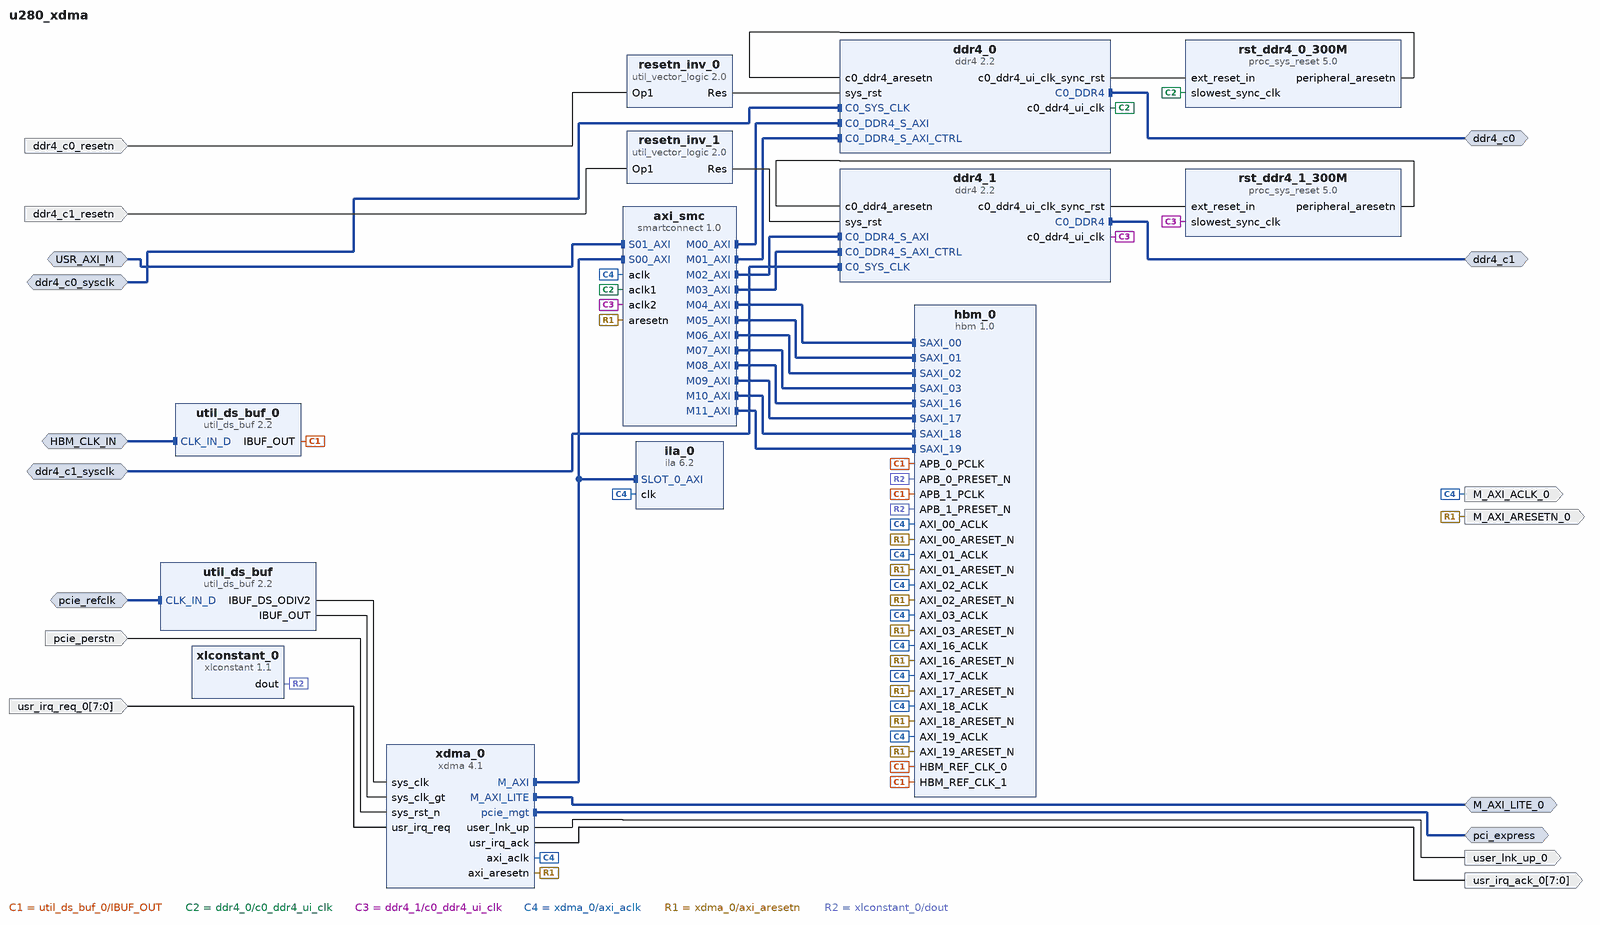
[diagram p0: block diagram of the top level]
# Vivado block design u280_xdma, xcu280-fsvh2892-2L-e, Vivado 2022.2
create_bd_design u280_xdma

create_bd_intf_port -mode Master -vlnv xilinx.com:interface:ddr4_rtl:1.0 ddr4_c0
create_bd_intf_port -mode Slave -vlnv xilinx.com:interface:diff_clock_rtl:1.0 ddr4_c0_sysclk
set_property -dict {CONFIG.FREQ_HZ 100000000} [get_bd_intf_ports ddr4_c0_sysclk]
create_bd_intf_port -mode Master -vlnv xilinx.com:interface:pcie_7x_mgt_rtl:1.0 pci_express
create_bd_intf_port -mode Slave -vlnv xilinx.com:interface:diff_clock_rtl:1.0 pcie_refclk
set_property -dict {CONFIG.FREQ_HZ 100000000} [get_bd_intf_ports pcie_refclk]
create_bd_intf_port -mode Master -vlnv xilinx.com:interface:aximm_rtl:1.0 M_AXI_LITE_0
set_property -dict [list \
  CONFIG.ADDR_WIDTH 32 \
  CONFIG.DATA_WIDTH 32 \
  CONFIG.HAS_BURST 0 \
  CONFIG.HAS_CACHE 0 \
  CONFIG.HAS_LOCK 0 \
  CONFIG.HAS_QOS 0 \
  CONFIG.HAS_REGION 0 \
  CONFIG.PROTOCOL AXI4LITE \
] [get_bd_intf_ports M_AXI_LITE_0]
create_bd_intf_port -mode Master -vlnv xilinx.com:interface:ddr4_rtl:1.0 ddr4_c1
create_bd_intf_port -mode Slave -vlnv xilinx.com:interface:diff_clock_rtl:1.0 ddr4_c1_sysclk
set_property -dict {CONFIG.FREQ_HZ 100000000} [get_bd_intf_ports ddr4_c1_sysclk]
create_bd_intf_port -mode Slave -vlnv xilinx.com:interface:diff_clock_rtl:1.0 HBM_CLK_IN
create_bd_intf_port -mode Slave -vlnv xilinx.com:interface:aximm_rtl:1.0 USR_AXI_M
set_property -dict [list \
  CONFIG.ADDR_WIDTH 64 \
  CONFIG.ARUSER_WIDTH 0 \
  CONFIG.AWUSER_WIDTH 0 \
  CONFIG.BUSER_WIDTH 0 \
  CONFIG.CLK_DOMAIN u280_xdma_xdma_0_1_axi_aclk \
  CONFIG.DATA_WIDTH 512 \
  CONFIG.FREQ_HZ 250000000 \
  CONFIG.HAS_BRESP 1 \
  CONFIG.HAS_BURST 1 \
  CONFIG.HAS_CACHE 1 \
  CONFIG.HAS_LOCK 1 \
  CONFIG.HAS_PROT 1 \
  CONFIG.HAS_QOS 1 \
  CONFIG.HAS_REGION 1 \
  CONFIG.HAS_RRESP 1 \
  CONFIG.HAS_WSTRB 1 \
  CONFIG.ID_WIDTH 4 \
  CONFIG.MAX_BURST_LENGTH 256 \
  CONFIG.NUM_READ_OUTSTANDING 32 \
  CONFIG.NUM_READ_THREADS 1 \
  CONFIG.NUM_WRITE_OUTSTANDING 16 \
  CONFIG.NUM_WRITE_THREADS 1 \
  CONFIG.PROTOCOL AXI4 \
  CONFIG.READ_WRITE_MODE READ_WRITE \
  CONFIG.RUSER_BITS_PER_BYTE 0 \
  CONFIG.RUSER_WIDTH 0 \
  CONFIG.SUPPORTS_NARROW_BURST 0 \
  CONFIG.WUSER_BITS_PER_BYTE 0 \
  CONFIG.WUSER_WIDTH 0 \
  CONFIG.master_id 2 \
] [get_bd_intf_ports USR_AXI_M]
create_bd_port -dir I -type rst pcie_perstn
set_property -dict {CONFIG.POLARITY ACTIVE_LOW} [get_bd_ports pcie_perstn]
create_bd_port -dir O -type clk M_AXI_ACLK_0
create_bd_port -dir O -type rst M_AXI_ARESETN_0
create_bd_port -dir O user_lnk_up_0
create_bd_port -dir O -from 7 -to 0 usr_irq_ack_0
create_bd_port -dir I -type rst ddr4_c0_resetn
set_property -dict {CONFIG.POLARITY ACTIVE_LOW} [get_bd_ports ddr4_c0_resetn]
create_bd_port -dir I -from 7 -to 0 usr_irq_req_0
create_bd_port -dir I -type rst ddr4_c1_resetn
set_property -dict {CONFIG.POLARITY ACTIVE_LOW} [get_bd_ports ddr4_c1_resetn]

create_bd_cell -type ip -vlnv xilinx.com:ip:ddr4:2.2 ddr4_0
set_property -dict [list \
  CONFIG.C0_CLOCK_BOARD_INTERFACE sysclk0 \
  CONFIG.C0_DDR4_BOARD_INTERFACE ddr4_sdram_c0 \
  CONFIG.RESET_BOARD_INTERFACE resetn \
] [get_bd_cells ddr4_0]
create_bd_cell -type ip -vlnv xilinx.com:ip:xdma:4.1 xdma_0
set_property -dict [list \
  CONFIG.PCIE_BOARD_INTERFACE pci_express_x16 \
  CONFIG.SYS_RST_N_BOARD_INTERFACE pcie_perstn \
  CONFIG.axilite_master_en true \
  CONFIG.cfg_mgmt_if false \
  CONFIG.pf0_msi_enabled false \
  CONFIG.xdma_axi_intf_mm AXI_Memory_Mapped \
  CONFIG.xdma_num_usr_irq 8 \
] [get_bd_cells xdma_0]
create_bd_cell -type ip -vlnv xilinx.com:ip:util_ds_buf:2.2 util_ds_buf
set_property -dict {CONFIG.DIFF_CLK_IN_BOARD_INTERFACE pcie_refclk CONFIG.USE_BOARD_FLOW true} [get_bd_cells util_ds_buf]
create_bd_cell -type ip -vlnv xilinx.com:ip:smartconnect:1.0 axi_smc
set_property -dict [list \
  CONFIG.ADVANCED_PROPERTIES { __view__ { }} \
  CONFIG.NUM_CLKS 3 \
  CONFIG.NUM_MI 12 \
  CONFIG.NUM_SI 2 \
] [get_bd_cells axi_smc]
create_bd_cell -type ip -vlnv xilinx.com:ip:proc_sys_reset:5.0 rst_ddr4_0_300M
create_bd_cell -type ip -vlnv xilinx.com:ip:util_vector_logic:2.0 resetn_inv_0
set_property -dict {CONFIG.C_OPERATION not CONFIG.C_SIZE 1} [get_bd_cells resetn_inv_0]
create_bd_cell -type ip -vlnv xilinx.com:ip:ddr4:2.2 ddr4_1
set_property -dict [list \
  CONFIG.C0_CLOCK_BOARD_INTERFACE sysclk1 \
  CONFIG.C0_DDR4_BOARD_INTERFACE ddr4_sdram_c1 \
  CONFIG.RESET_BOARD_INTERFACE resetn \
] [get_bd_cells ddr4_1]
create_bd_cell -type ip -vlnv xilinx.com:ip:util_vector_logic:2.0 resetn_inv_1
set_property -dict {CONFIG.C_OPERATION not CONFIG.C_SIZE 1} [get_bd_cells resetn_inv_1]
create_bd_cell -type ip -vlnv xilinx.com:ip:proc_sys_reset:5.0 rst_ddr4_1_300M
create_bd_cell -type ip -vlnv xilinx.com:ip:ila:6.2 ila_0
set_property -dict {CONFIG.C_DATA_DEPTH 4096} [get_bd_cells ila_0]
create_bd_cell -type ip -vlnv xilinx.com:ip:hbm:1.0 hbm_0
set_property -dict [list \
  CONFIG.USER_APB_EN false \
  CONFIG.USER_AUTO_POPULATE yes \
  CONFIG.USER_HBM_DENSITY 8GB \
  CONFIG.USER_MC0_TEMP_CTRL_SELF_REF_INTVL false \
  CONFIG.USER_MC_ENABLE_00 TRUE \
  CONFIG.USER_MC_ENABLE_02 FALSE \
  CONFIG.USER_MC_ENABLE_03 FALSE \
  CONFIG.USER_MC_ENABLE_04 FALSE \
  CONFIG.USER_MC_ENABLE_05 FALSE \
  CONFIG.USER_MC_ENABLE_06 FALSE \
  CONFIG.USER_MC_ENABLE_07 FALSE \
  CONFIG.USER_MC_ENABLE_10 FALSE \
  CONFIG.USER_MC_ENABLE_11 FALSE \
  CONFIG.USER_MC_ENABLE_12 FALSE \
  CONFIG.USER_MC_ENABLE_13 FALSE \
  CONFIG.USER_MC_ENABLE_14 FALSE \
  CONFIG.USER_MC_ENABLE_15 FALSE \
  CONFIG.USER_SAXI_19 true \
  CONFIG.USER_SWITCH_ENABLE_00 FALSE \
  CONFIG.USER_SWITCH_ENABLE_01 FALSE \
] [get_bd_cells hbm_0]
create_bd_cell -type ip -vlnv xilinx.com:ip:xlconstant:1.1 xlconstant_0
create_bd_cell -type ip -vlnv xilinx.com:ip:util_ds_buf:2.2 util_ds_buf_0

# ---- connections ----

connect_bd_intf_net -intf_net CLK_IN_D_0_1 [get_bd_intf_ports HBM_CLK_IN] [get_bd_intf_pins util_ds_buf_0/CLK_IN_D]
connect_bd_intf_net [get_bd_intf_ports USR_AXI_M] [get_bd_intf_pins axi_smc/S01_AXI]
connect_bd_intf_net [get_bd_intf_pins axi_smc/M00_AXI] [get_bd_intf_pins ddr4_0/C0_DDR4_S_AXI]
connect_bd_intf_net [get_bd_intf_pins axi_smc/M01_AXI] [get_bd_intf_pins ddr4_0/C0_DDR4_S_AXI_CTRL]
connect_bd_intf_net [get_bd_intf_pins ddr4_1/C0_DDR4_S_AXI] [get_bd_intf_pins axi_smc/M02_AXI]
connect_bd_intf_net [get_bd_intf_pins axi_smc/M03_AXI] [get_bd_intf_pins ddr4_1/C0_DDR4_S_AXI_CTRL]
connect_bd_intf_net [get_bd_intf_pins axi_smc/M04_AXI] [get_bd_intf_pins hbm_0/SAXI_00]
connect_bd_intf_net [get_bd_intf_pins axi_smc/M05_AXI] [get_bd_intf_pins hbm_0/SAXI_01]
connect_bd_intf_net [get_bd_intf_pins axi_smc/M06_AXI] [get_bd_intf_pins hbm_0/SAXI_02]
connect_bd_intf_net [get_bd_intf_pins axi_smc/M07_AXI] [get_bd_intf_pins hbm_0/SAXI_03]
connect_bd_intf_net [get_bd_intf_pins hbm_0/SAXI_16] [get_bd_intf_pins axi_smc/M08_AXI]
connect_bd_intf_net [get_bd_intf_pins hbm_0/SAXI_17] [get_bd_intf_pins axi_smc/M09_AXI]
connect_bd_intf_net [get_bd_intf_pins hbm_0/SAXI_18] [get_bd_intf_pins axi_smc/M10_AXI]
connect_bd_intf_net [get_bd_intf_pins hbm_0/SAXI_19] [get_bd_intf_pins axi_smc/M11_AXI]
connect_bd_intf_net [get_bd_intf_ports ddr4_c0] [get_bd_intf_pins ddr4_0/C0_DDR4]
connect_bd_intf_net [get_bd_intf_ports ddr4_c1] [get_bd_intf_pins ddr4_1/C0_DDR4]
connect_bd_intf_net [get_bd_intf_ports pcie_refclk] [get_bd_intf_pins util_ds_buf/CLK_IN_D]
connect_bd_intf_net -intf_net sysclk0_1 [get_bd_intf_ports ddr4_c0_sysclk] [get_bd_intf_pins ddr4_0/C0_SYS_CLK]
connect_bd_intf_net -intf_net sysclk1_1 [get_bd_intf_ports ddr4_c1_sysclk] [get_bd_intf_pins ddr4_1/C0_SYS_CLK]
connect_bd_intf_net [get_bd_intf_pins xdma_0/M_AXI] [get_bd_intf_pins axi_smc/S00_AXI]
connect_bd_intf_net [get_bd_intf_pins xdma_0/M_AXI] [get_bd_intf_pins ila_0/SLOT_0_AXI]
connect_bd_intf_net [get_bd_intf_ports M_AXI_LITE_0] [get_bd_intf_pins xdma_0/M_AXI_LITE]
connect_bd_intf_net [get_bd_intf_ports pci_express] [get_bd_intf_pins xdma_0/pcie_mgt]
connect_bd_net -net clk_100MHz_1 [get_bd_pins util_ds_buf_0/IBUF_OUT] \
  [get_bd_pins hbm_0/HBM_REF_CLK_0] [get_bd_pins hbm_0/APB_0_PCLK] [get_bd_pins hbm_0/APB_1_PCLK] \
  [get_bd_pins hbm_0/HBM_REF_CLK_1]
connect_bd_net [get_bd_pins ddr4_0/c0_ddr4_ui_clk] [get_bd_pins rst_ddr4_0_300M/slowest_sync_clk] [get_bd_pins axi_smc/aclk1]
connect_bd_net [get_bd_pins ddr4_0/c0_ddr4_ui_clk_sync_rst] [get_bd_pins rst_ddr4_0_300M/ext_reset_in]
connect_bd_net [get_bd_pins ddr4_1/c0_ddr4_ui_clk] [get_bd_pins rst_ddr4_1_300M/slowest_sync_clk] [get_bd_pins axi_smc/aclk2]
connect_bd_net [get_bd_pins ddr4_1/c0_ddr4_ui_clk_sync_rst] [get_bd_pins rst_ddr4_1_300M/ext_reset_in]
connect_bd_net [get_bd_ports pcie_perstn] [get_bd_pins xdma_0/sys_rst_n]
connect_bd_net -net resetn_1 [get_bd_ports ddr4_c0_resetn] [get_bd_pins resetn_inv_0/Op1]
connect_bd_net -net resetn_2 [get_bd_ports ddr4_c1_resetn] [get_bd_pins resetn_inv_1/Op1]
connect_bd_net [get_bd_pins resetn_inv_0/Res] [get_bd_pins ddr4_0/sys_rst]
connect_bd_net [get_bd_pins resetn_inv_1/Res] [get_bd_pins ddr4_1/sys_rst]
connect_bd_net [get_bd_pins rst_ddr4_0_300M/peripheral_aresetn] [get_bd_pins ddr4_0/c0_ddr4_aresetn]
connect_bd_net [get_bd_pins rst_ddr4_1_300M/peripheral_aresetn] [get_bd_pins ddr4_1/c0_ddr4_aresetn]
connect_bd_net -net usr_irq_req_0_1 [get_bd_ports usr_irq_req_0] [get_bd_pins xdma_0/usr_irq_req]
connect_bd_net [get_bd_pins util_ds_buf/IBUF_DS_ODIV2] [get_bd_pins xdma_0/sys_clk]
connect_bd_net [get_bd_pins util_ds_buf/IBUF_OUT] [get_bd_pins xdma_0/sys_clk_gt]
connect_bd_net [get_bd_pins xdma_0/axi_aclk] \
  [get_bd_ports M_AXI_ACLK_0] [get_bd_pins axi_smc/aclk] [get_bd_pins ila_0/clk] [get_bd_pins hbm_0/AXI_00_ACLK] \
  [get_bd_pins hbm_0/AXI_01_ACLK] [get_bd_pins hbm_0/AXI_02_ACLK] [get_bd_pins hbm_0/AXI_03_ACLK] \
  [get_bd_pins hbm_0/AXI_16_ACLK] [get_bd_pins hbm_0/AXI_17_ACLK] [get_bd_pins hbm_0/AXI_18_ACLK] \
  [get_bd_pins hbm_0/AXI_19_ACLK]
connect_bd_net [get_bd_pins xdma_0/axi_aresetn] \
  [get_bd_ports M_AXI_ARESETN_0] [get_bd_pins axi_smc/aresetn] [get_bd_pins hbm_0/AXI_00_ARESET_N] \
  [get_bd_pins hbm_0/AXI_01_ARESET_N] [get_bd_pins hbm_0/AXI_02_ARESET_N] [get_bd_pins hbm_0/AXI_03_ARESET_N] \
  [get_bd_pins hbm_0/AXI_19_ARESET_N] [get_bd_pins hbm_0/AXI_18_ARESET_N] [get_bd_pins hbm_0/AXI_17_ARESET_N] \
  [get_bd_pins hbm_0/AXI_16_ARESET_N]
connect_bd_net [get_bd_pins xdma_0/user_lnk_up] [get_bd_ports user_lnk_up_0]
connect_bd_net [get_bd_pins xdma_0/usr_irq_ack] [get_bd_ports usr_irq_ack_0]
connect_bd_net [get_bd_pins xlconstant_0/dout] [get_bd_pins hbm_0/APB_0_PRESET_N] [get_bd_pins hbm_0/APB_1_PRESET_N]

# ---- address map ----
assign_bd_address -offset 0x0000000000000000 -range 16G -target_address_space [get_bd_addr_spaces USR_AXI_M] [get_bd_addr_segs ddr4_0/C0_DDR4_MEMORY_MAP/C0_DDR4_ADDRESS_BLOCK]
assign_bd_address -offset 0x0000000400000000 -range 16G -target_address_space [get_bd_addr_spaces USR_AXI_M] [get_bd_addr_segs ddr4_1/C0_DDR4_MEMORY_MAP/C0_DDR4_ADDRESS_BLOCK]
assign_bd_address -offset 0x0000000800000000 -range 1M -target_address_space [get_bd_addr_spaces USR_AXI_M] [get_bd_addr_segs ddr4_0/C0_DDR4_MEMORY_MAP_CTRL/C0_REG]
assign_bd_address -offset 0x0000000800100000 -range 1M -target_address_space [get_bd_addr_spaces USR_AXI_M] [get_bd_addr_segs ddr4_1/C0_DDR4_MEMORY_MAP_CTRL/C0_REG]
assign_bd_address -offset 0x0000001000000000 -range 256M -target_address_space [get_bd_addr_spaces USR_AXI_M] [get_bd_addr_segs hbm_0/SAXI_00/HBM_MEM00]
assign_bd_address -offset 0x0000001010000000 -range 256M -target_address_space [get_bd_addr_spaces USR_AXI_M] [get_bd_addr_segs hbm_0/SAXI_01/HBM_MEM01]
assign_bd_address -offset 0x0000001020000000 -range 256M -target_address_space [get_bd_addr_spaces USR_AXI_M] [get_bd_addr_segs hbm_0/SAXI_02/HBM_MEM02]
assign_bd_address -offset 0x0000001030000000 -range 256M -target_address_space [get_bd_addr_spaces USR_AXI_M] [get_bd_addr_segs hbm_0/SAXI_03/HBM_MEM03]
assign_bd_address -offset 0x0000001100000000 -range 256M -target_address_space [get_bd_addr_spaces USR_AXI_M] [get_bd_addr_segs hbm_0/SAXI_16/HBM_MEM16]
assign_bd_address -offset 0x0000001110000000 -range 256M -target_address_space [get_bd_addr_spaces USR_AXI_M] [get_bd_addr_segs hbm_0/SAXI_17/HBM_MEM17]
assign_bd_address -offset 0x0000001120000000 -range 256M -target_address_space [get_bd_addr_spaces USR_AXI_M] [get_bd_addr_segs hbm_0/SAXI_18/HBM_MEM18]
assign_bd_address -offset 0x0000001130000000 -range 256M -target_address_space [get_bd_addr_spaces USR_AXI_M] [get_bd_addr_segs hbm_0/SAXI_19/HBM_MEM19]
assign_bd_address -offset 0x0000000000000000 -range 16G -target_address_space [get_bd_addr_spaces xdma_0/M_AXI] [get_bd_addr_segs ddr4_0/C0_DDR4_MEMORY_MAP/C0_DDR4_ADDRESS_BLOCK]
assign_bd_address -offset 0x0000000400000000 -range 16G -target_address_space [get_bd_addr_spaces xdma_0/M_AXI] [get_bd_addr_segs ddr4_1/C0_DDR4_MEMORY_MAP/C0_DDR4_ADDRESS_BLOCK]
assign_bd_address -offset 0x0000000800000000 -range 1M -target_address_space [get_bd_addr_spaces xdma_0/M_AXI] [get_bd_addr_segs ddr4_0/C0_DDR4_MEMORY_MAP_CTRL/C0_REG]
assign_bd_address -offset 0x0000000800100000 -range 1M -target_address_space [get_bd_addr_spaces xdma_0/M_AXI] [get_bd_addr_segs ddr4_1/C0_DDR4_MEMORY_MAP_CTRL/C0_REG]
assign_bd_address -offset 0x0000001000000000 -range 256M -target_address_space [get_bd_addr_spaces xdma_0/M_AXI] [get_bd_addr_segs hbm_0/SAXI_00/HBM_MEM00]
assign_bd_address -offset 0x0000001010000000 -range 256M -target_address_space [get_bd_addr_spaces xdma_0/M_AXI] [get_bd_addr_segs hbm_0/SAXI_01/HBM_MEM01]
assign_bd_address -offset 0x0000001020000000 -range 256M -target_address_space [get_bd_addr_spaces xdma_0/M_AXI] [get_bd_addr_segs hbm_0/SAXI_02/HBM_MEM02]
assign_bd_address -offset 0x0000001030000000 -range 256M -target_address_space [get_bd_addr_spaces xdma_0/M_AXI] [get_bd_addr_segs hbm_0/SAXI_03/HBM_MEM03]
assign_bd_address -offset 0x0000001100000000 -range 256M -target_address_space [get_bd_addr_spaces xdma_0/M_AXI] [get_bd_addr_segs hbm_0/SAXI_16/HBM_MEM16]
assign_bd_address -offset 0x0000001110000000 -range 256M -target_address_space [get_bd_addr_spaces xdma_0/M_AXI] [get_bd_addr_segs hbm_0/SAXI_17/HBM_MEM17]
assign_bd_address -offset 0x0000001120000000 -range 256M -target_address_space [get_bd_addr_spaces xdma_0/M_AXI] [get_bd_addr_segs hbm_0/SAXI_18/HBM_MEM18]
assign_bd_address -offset 0x0000001130000000 -range 256M -target_address_space [get_bd_addr_spaces xdma_0/M_AXI] [get_bd_addr_segs hbm_0/SAXI_19/HBM_MEM19]
assign_bd_address -offset 0x00000000 -range 64K -target_address_space [get_bd_addr_spaces xdma_0/M_AXI_LITE] [get_bd_addr_segs M_AXI_LITE_0/Reg]

validate_bd_design
save_bd_design
